# EAGLE design teensy_amp_loads_of_switches (EAGLE 9.6.2)
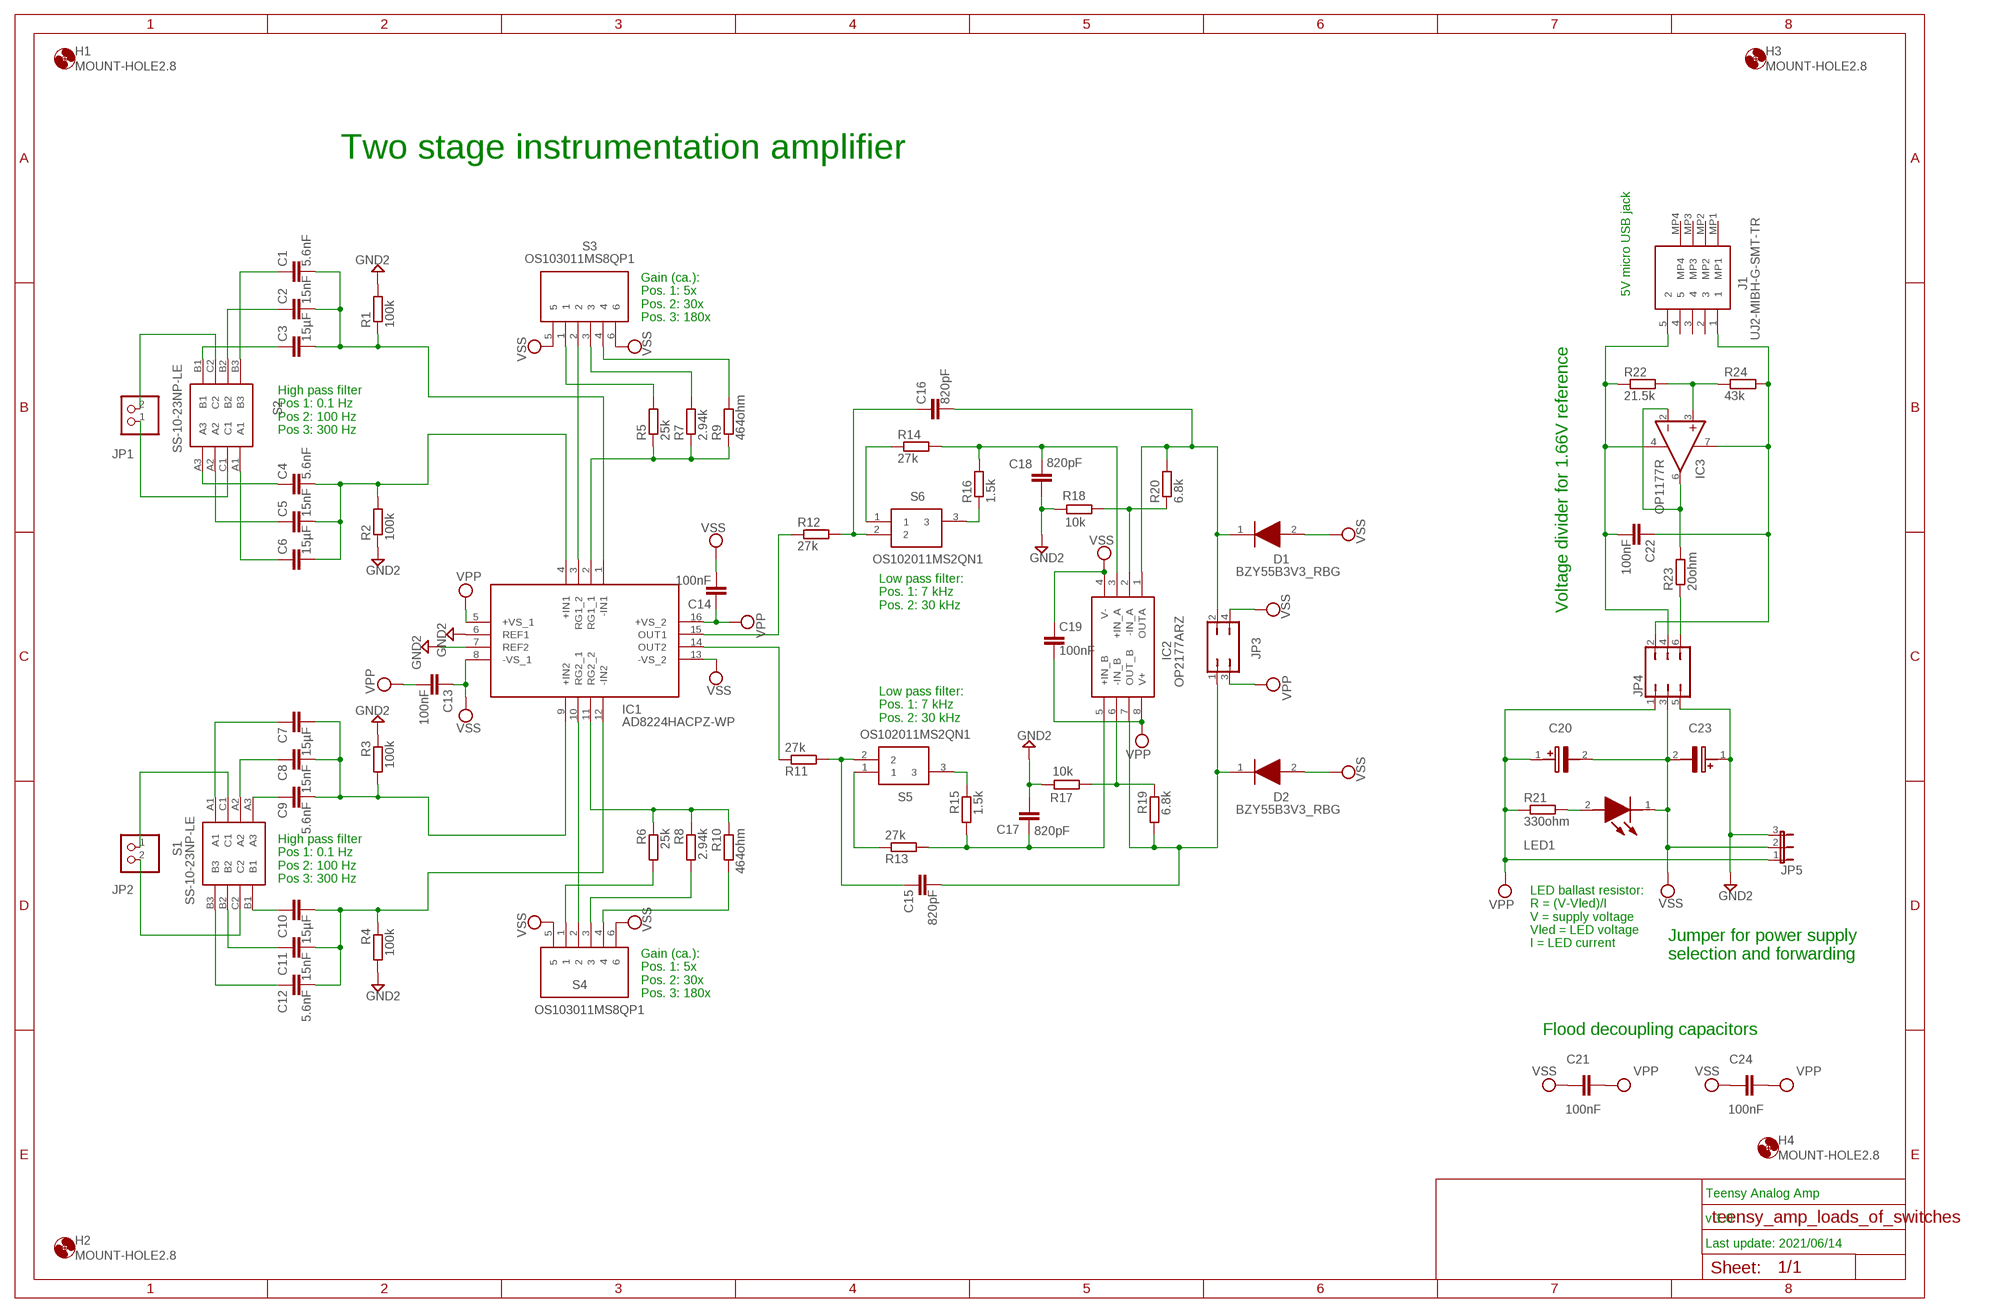
[diagram p0: schematic, sheet 1]

## Parts
C1  5.6nF  C-EUC0805  [C0805]
C2  15nF  C-EUC0805  [C0805]
C3  15µF  C-EUC0805  [C0805]
C4  5.6nF  C-EUC0805  [C0805]
C5  15nF  C-EUC0805  [C0805]
C6  15µF  C-EUC0805  [C0805]
C7  15µF  C-EUC0805  [C0805]
C8  15nF  C-EUC0805  [C0805]
C9  5.6nF  C-EUC0805  [C0805]
C10  15µF  C-EUC0805  [C0805]
C11  15nF  C-EUC0805  [C0805]
C12  5.6nF  C-EUC0805  [C0805]
C13  100nF  C-EUC0805  [C0805]
C14  100nF  C-EUC0805  [C0805]
C15  820pF  C-EUC0805  [C0805]
C16  820pF  C-EUC0805  [C0805]
C17  820pF  C-EUC0805  [C0805]
C18  820pF  C-EUC0805  [C0805]
C19  100nF  C-EUC0805  [C0805]
C20  TAJA475K010RNJV  [CAPPM3216X180N]
C21  100nF  C-EUC0805  [C0805]
C22  100nF  C-EUC0805  [C0805]
C23  TAJA475K010RNJV  [CAPPM3216X180N]
C24  100nF  C-EUC0805  [C0805]
D1  BZY55B3V3_RBG  [BZY55B3V3RBG]
D2  BZY55B3V3_RBG  [BZY55B3V3RBG]
H1  MOUNT-HOLE2.8  [2,8]
H2  MOUNT-HOLE2.8  [2,8]
H3  MOUNT-HOLE2.8  [2,8]
H4  MOUNT-HOLE2.8  [2,8]
IC1  AD8224HACPZ-WP  [QFN65P400X400X100-16N]
IC2  OP2177ARZ  [SOIC127P600X175-8N]
IC3  OP1177R  [SOIC8]
J1  UJ2-MIBH-G-SMT-TR  [UJ2MIBHGSMTTR]
JP1  PINHD-1X2  [1X02]
JP2  PINHD-1X2  [1X02]
JP3  JP2Q  [JP2Q]
JP4  JP3Q  [JP3Q]
JP5  JP2E  [JP2]
LED1  150060RS75000  [LEDC1608X80N]
R1  100k  R-EU_R0805  [R0805]
R2  100k  R-EU_R0805  [R0805]
R3  100k  R-EU_R0805  [R0805]
R4  100k  R-EU_R0805  [R0805]
R5  25k  R-EU_R0805  [R0805]
R6  25k  R-EU_R0805  [R0805]
R7  2.94k  R-EU_R0805  [R0805]
R8  2.94k  R-EU_R0805  [R0805]
R9  464ohm  R-EU_R0805  [R0805]
R10  464ohm  R-EU_R0805  [R0805]
R11  27k  R-EU_R0805  [R0805]
R12  27k  R-EU_R0805  [R0805]
R13  27k  R-EU_R0805  [R0805]
R14  27k  R-EU_R0805  [R0805]
R15  1.5k  R-EU_R0805  [R0805]
R16  1.5k  R-EU_R0805  [R0805]
R17  10k  R-EU_R0805  [R0805]
R18  10k  R-EU_R0805  [R0805]
R19  6.8k  R-EU_R0805  [R0805]
R20  6.8k  R-EU_R0805  [R0805]
R21  330ohm  R-EU_R0805  [R0805]
R22  21.5k  R-EU_R0805  [R0805]
R23  20ohm  R-EU_R0805  [R0805]
R24  43k  R-EU_R0805  [R0805]
S1  SS-10-23NP-LE  [SS1023NPLE]
S2  SS-10-23NP-LE  [SS1023NPLE]
S3  OS103011MS8QP1  [OS103011MS8QP1]
S4  OS103011MS8QP1  [OS103011MS8QP1]
S5  OS102011MS2QN1  [OS102011MA1QN1]
S6  OS102011MS2QN1  [OS102011MA1QN1]

## Nets
GND2: C17.2 C18.2 C23.1(+) IC1.6(REF1) IC1.7(REF2) JP4.5 JP5.3 R1.2 R2.1 R3.1 R4.2 R17.2 R18.2
N$1: JP1.2 S2.C2
N$2: JP1.1 S2.C1
N$3: C16.1 R12.2 S6.2
N$4: C4.1 S2.A3
N$5: C5.1 S2.A2
N$6: C6.1 S2.A1
N$7: LED1.2(A) R21.2
N$8: C22.2 IC3.4(V-) J1.5 JP4.4 R22.1
N$9: IC3.3(+IN) R22.2 R24.1
N$10: IC3.2(-IN) IC3.6(OUT) R23.2
N$11: C22.1 IC3.7(V+) J1.1 JP4.2 R24.2
N$12: C3.1 S2.B1
N$14: C1.1 S2.B3
N$15: C4.2 C5.2 C6.2 IC1.4(+IN1) R2.2
N$16: C1.2 C2.2 C3.2 IC1.1(-IN1) R1.1
N$17: C2.1 S2.B2
N$18: IC1.3(RG1_2) S3.2
N$19: IC1.15(OUT1) R12.1
N$20: IC2.2(-IN_A) R18.1 R20.1
N$21: C11.1 S1.B2
N$22: C18.1 IC2.3(+IN_A) R14.2 R16.2
N$23: R6.2 S4.1
N$24: R8.2 S4.3
N$25: R10.2 S4.4
N$26: IC1.11(RG2_2) R6.1 R8.1 R10.1
N$27: JP2.2 S1.C2
N$28: JP2.1 S1.C1
N$29: C9.1 S1.A3
N$30: R5.2 S3.1
N$31: R7.2 S3.3
N$32: R9.2 S3.4
N$33: IC1.2(RG1_1) R5.1 R7.1 R9.1
N$34: C8.1 S1.A2
N$35: C7.1 S1.A1
N$36: C10.1 S1.B1
N$37: C12.1 S1.B3
N$38: C7.2 C8.2 C9.2 IC1.9(+IN2) R3.2
N$39: C10.2 C11.2 C12.2 IC1.12(-IN2) R4.1
N$40: IC1.10(RG2_1) S4.2
N$41: JP4.6 R23.1
N$46: R14.1 S6.1
N$47: C16.2 D1.1(K) IC2.1(OUTA) JP3.2 R20.2
N$48: R16.1 S6.3
N$49: IC1.14(OUT2) R11.1
N$50: C17.1 IC2.5(+IN_B) R13.2 R15.2
N$51: IC2.6(-IN_B) R17.1 R19.1
N$52: C15.2 D2.1(K) IC2.7(OUT_B) JP3.1 R19.2
N$53: R13.1 S5.1
N$54: C15.1 R11.2 S5.2
N$55: R15.1 S5.3
VPP: C13.2 C14.1 C19.2 C20.1(+) C21.2 C24.2 IC1.5(+VS_1) IC1.16(+VS_2) IC2.8(V+) JP3.3 JP4.1 JP5.1 R21.1
VSS: C13.1 C14.2 C19.1 C20.2(-) C21.1 C23.2(-) C24.1 D1.2(A) D2.2(A) IC1.8(-VS_1) IC1.13(-VS_2) IC2.4(V-) JP3.4 JP4.3 JP5.2 LED1.1(K) S3.5 S3.6 S4.5 S4.6
Unconnected: J1.2 J1.3 J1.4 J1.MP1 J1.MP2 J1.MP3 J1.MP4

## Notes on the sheet
- Two stage instrumentation amplifier
- 5V micro USB jack
- Gain (ca.):
  Pos. 1: 5x
  Pos. 2: 30x
  Pos. 3: 180x
- Voltage divider for 1.66V reference
- High pass filter
  Pos 1: 0.1 Hz
  Pos 2: 100 Hz
  Pos 3: 300 Hz
- Low pass filter:
  Pos. 1: 7 kHz
  Pos. 2: 30 kHz
- Low pass filter:
  Pos. 1: 7 kHz
  Pos. 2: 30 kHz
- High pass filter
  Pos 1: 0.1 Hz
  Pos 2: 100 Hz
  Pos 3: 300 Hz
- LED ballast resistor:
  R = (V-Vled)/I
  V = supply voltage
  Vled = LED voltage
  I = LED current
- Jumper for power supply
  selection and forwarding
- Gain (ca.):
  Pos. 1: 5x
  Pos. 2: 30x
  Pos. 3: 180x
- Flood decoupling capacitors
- Teensy Analog Amp
- v 1.0
- Last update: 2021/06/14

## Library data of the parts
C1-C19 C21 C22 C24 = rcl:C-EU: CAPACITOR, European symbol; SPICEPREFIX: C
C20 C23 = SamacSys_Parts:TAJA475K010RNJV: Tantalum Capacitors - Solid SMD 10V 4.7uF 10% 1206 ESR = 5 Ohms Source: Datasheet; DESCRIPTION: Tantalum Capacitors - Solid SMD 10V 4.7uF 10% 1206 ESR = 5 Ohms; HEIGHT: 1.8mm; MANUFACTURER_NAME: AVX; MANUFACTURER_PART_NUMBER: TAJA475K010RNJV; MOUSER_PART_NUMBER: 581-TAJA475K010RNJV; MOUSER_PRICE-STOCK: https://www.mouser.co.uk/ProductDetail/AVX/TAJA475K010RNJV?qs=VymPLiRQZITld0CPYYWYtw%3D%3D
D1 D2 = SamacSys_Parts:BZY55B3V3_RBG: - Tape and Reel Source: Datasheet <https://componentsearchengine.com/Datasheets/1/BZY55B3V3 RBG.pdf>; DESCRIPTION: - Tape and Reel; HEIGHT: 0.85mm; MANUFACTURER_NAME: Taiwan Semiconductor; MANUFACTURER_PART_NUMBER: BZY55B3V3 RBG; MOUSER_PART_NUMBER: 821-BZY55B3V3RBG; MOUSER_PRICE-STOCK: https://www.mouser.co.uk/ProductDetail/Taiwan-Semiconductor/BZY55B3V3-RBG?qs=mAH9sUMRCtvrJdI%2FtfeTug%3D%3D
H1-H4 = holes:MOUNT-HOLE: MOUNTING HOLE with drill center marker
IC1 = SamacSys_Parts:AD8224HACPZ-WP: Precision, Dual-Channel, JFET Input,Rail-to-Rail Instrumentation Amplifier Source: Datasheet <https://componentsearchengine.com/Datasheets/2/AD8224HACPZ-WP.pdf>; DESCRIPTION: Precision, Dual-Channel, JFET Input,Rail-to-Rail Instrumentation Amplifier; HEIGHT: 1mm; MANUFACTURER_NAME: Analog Devices; MANUFACTURER_PART_NUMBER: AD8224HACPZ-WP; MOUSER_PART_NUMBER: 584-AD8224HACPZ-WP; MOUSER_PRICE-STOCK: https://www.mouser.co.uk/ProductDetail/Analog-Devices/AD8224HACPZ-WP?qs=%2FtpEQrCGXCwdne337I0uOQ%3D%3D
IC2 = SamacSys_Parts:OP2177ARZ: OP2177ARZ, Dual Operational Amplifier 1.3MHz, 8-Pin SOIC Source: Datasheet; DESCRIPTION: OP2177ARZ, Dual Operational Amplifier 1.3MHz, 8-Pin SOIC; HEIGHT: 1.75mm; MANUFACTURER_NAME: Analog Devices; MANUFACTURER_PART_NUMBER: OP2177ARZ; MOUSER_PART_NUMBER: 584-OP2177ARZ; MOUSER_PRICE-STOCK: https://www.mouser.co.uk/ProductDetail/Analog-Devices/OP2177ARZ?qs=WIvQP4zGaniPKKe90KoQ%252BA%3D%3D
IC3 = linear:OP1177: Precision Low Noise, Low Input Bias Current Operational Amplifiers Source: OP1177_2177_4177.pdf
J1 = SamacSys_Parts:UJ2-MIBH-G-SMT-TR: USB Connectors Source: Datasheet; DESCRIPTION: USB Connectors; HEIGHT: 3.15mm; MANUFACTURER_NAME: CUI Inc.; MANUFACTURER_PART_NUMBER: UJ2-MIBH-G-SMT-TR; MOUSER_PART_NUMBER: 490-UJ2-MIBH-G-SMTTR; MOUSER_PRICE-STOCK: https://www.mouser.co.uk/ProductDetail/CUI-Devices/UJ2-MIBH-G-SMT-TR?qs=IS%252B4QmGtzzpvS1XQusp0iA%3D%3D
JP1 JP2 = pinhead:PINHD-1X2: PIN HEADER
JP3 = jumper:JP2Q: JUMPER
JP4 = jumper:JP3Q: JUMPER
JP5 = jumper:JP2E: JUMPER
LED1 = SamacSys_Parts:150060RS75000: WURTH ELEKTRONIK - 150060RS75000 - LED, 0603, RED, 250MCD, 625NM Source: Datasheet <http://katalog.we-online.de/led/datasheet/150060RS75000.pdf>; DESCRIPTION: WURTH ELEKTRONIK - 150060RS75000 - LED, 0603, RED, 250MCD, 625NM; HEIGHT: 0.8mm; MANUFACTURER_NAME: Wurth Elektronik; MANUFACTURER_PART_NUMBER: 150060RS75000; MOUSER_PART_NUMBER: 710-150060RS75000; MOUSER_PRICE-STOCK: https://www.mouser.co.uk/ProductDetail/Wurth-Elektronik/150060RS75000?qs=LlUlMxKIyB3QnmZ3fw%2FVCA%3D%3D
R1-R24 = rcl:R-EU_: RESISTOR, European symbol; SPICEPREFIX: R
S1 S2 = SamacSys_Parts:SS-10-23NP-LE: Copal Electronics SS-10, 3 Position DP3T Rotary Switch, 100 mA, Solder Source: Datasheet <https://www.nidec-copal-electronics.com/e/catalog/switch/ss-10&s-2050.pdf>; DESCRIPTION: Copal Electronics SS-10, 3 Position DP3T Rotary Switch, 100 mA, Solder; HEIGHT: 7mm; MANUFACTURER_NAME: Copal Electronics; MANUFACTURER_PART_NUMBER: SS-10-23NP-LE
S3 S4 = SamacSys_Parts:OS103011MS8QP1: C & K COMPONENTS - OS103011MS8QP1 - SWITCH, SP3T, 0.1A, 12VDC, PCB, ON-ON-ON Source: Datasheet <https://www.ckswitches.com/media/1428/os.pdf>; DESCRIPTION: C & K COMPONENTS - OS103011MS8QP1 - SWITCH, SP3T, 0.1A, 12VDC, PCB, ON-ON-ON; HEIGHT: 8mm; MANUFACTURER_NAME: C & K COMPONENTS; MANUFACTURER_PART_NUMBER: OS103011MS8QP1; MOUSER_PART_NUMBER: 611-OS103011MS8QP1; MOUSER_PRICE-STOCK: https://www.mouser.co.uk/ProductDetail/CK/OS103011MS8QP1/?qs=86ySKn7Oc5W2%252Bzm5uDBfBA%3D%3D
S5 S6 = SamacSys_Parts:OS102011MS2QN1: Switch Slide Miniature SPDT 0.1A 12VDC Through Hole Slide Switch SPDT On-On 0.1 A@ 12 V dc Slide Source: Datasheet <http://www.ckswitches.com/media/1428/os.pdf>; DESCRIPTION: Switch Slide Miniature SPDT 0.1A 12VDC Through Hole Slide Switch SPDT On-On 0.1 A@ 12 V dc Slide; HEIGHT: mm; MANUFACTURER_NAME: C & K COMPONENTS; MANUFACTURER_PART_NUMBER: OS102011MS2QN1; MOUSER_PART_NUMBER: 611-OS102011MS2QN1; MOUSER_PRICE-STOCK: https://www.mouser.co.uk/ProductDetail/CK/OS102011MS2QN1?qs=WtljUlYws5RvQ1hEv876nQ%3D%3D

## Net classes
0 default: width 0.203 mm, clearance 0.205 mm

## Board
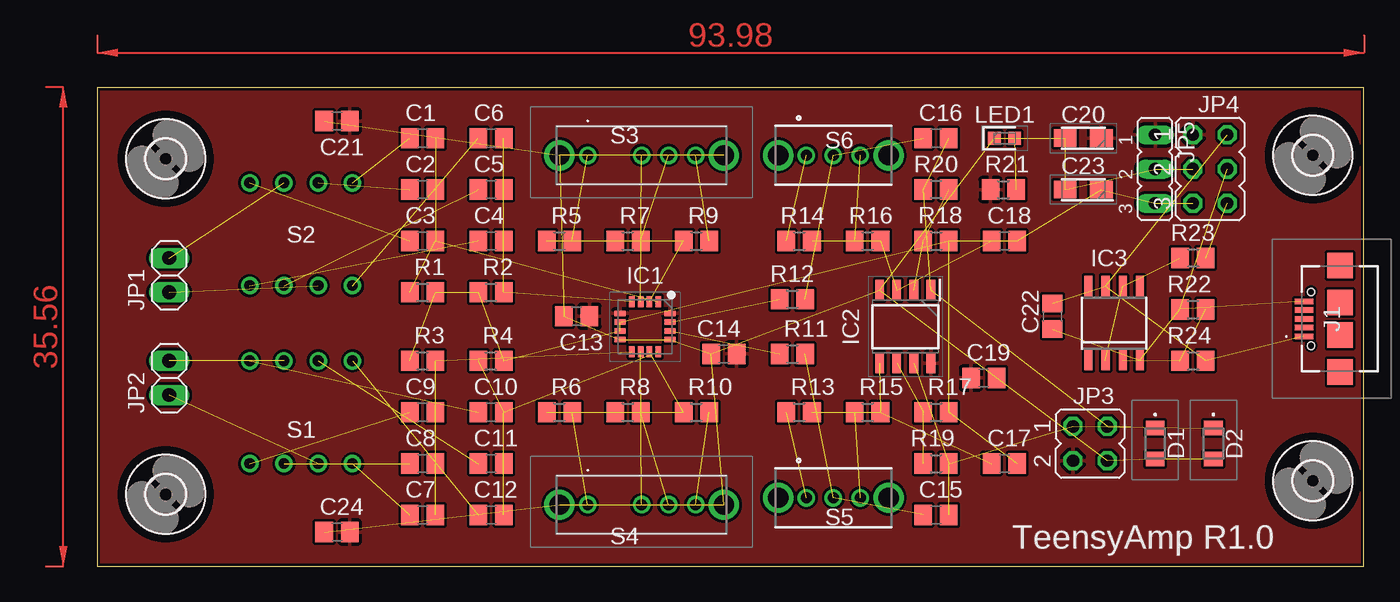
[diagram p1: board, top side]
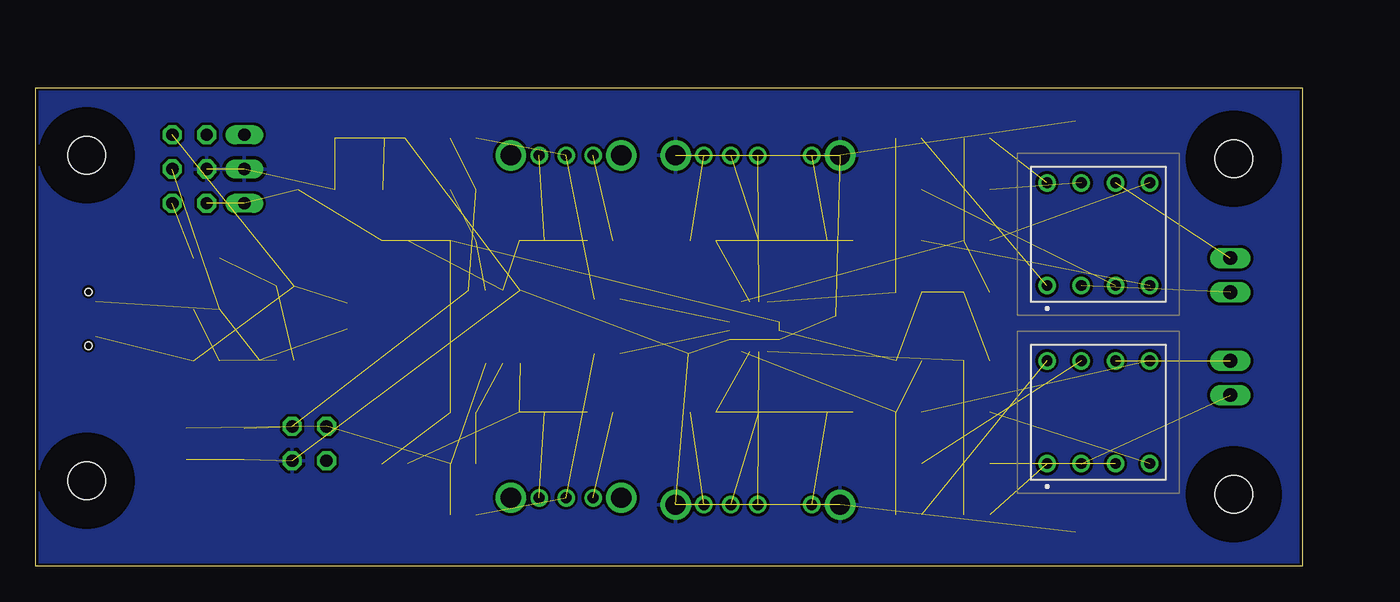
[diagram p2: board, bottom side, seen from below]

Size 93.96 x 35.48 mm. Coordinates in mm from the lower left corner, seen from the top.
Outline: 0,0 93.96,0 93.96,35.48 0,35.48 0,0
Copper layers (1*16): Top 0.035mm / dielectric 1.5mm / Bottom 0.035mm
Design rules "aisler_2_layer": minimum track width 0.1mm, minimum drill 0.2mm, track to track 0.15mm, track to pad 0.15mm, pad to pad 0.1mm, via to via 0.1mm, smd to smd 0.1mm, copper to edge 0.2mm, drill to drill 0.21mm, minimum pad ring 0.25mm, minimum via ring 0.15mm, stop-mask expansion 0mil, vias tented up to drill 0mil, thermal gap 10mil

### Footprints (pad centres in the part's own frame; a part is rotated, then mirrored left to right if it is on the bottom)
C0805 = smd 1.3 x 1.5: 1 -0.95,0; 2 0.95,0
CAPPM3216X180N = smd 1.7 x 1.3: 1 -1.35,0; 2 1.35,0
BZY55B3V3RBG = smd 1.1 x 1.4: 1 -1.15,0; 2 1.15,0
2,8 = hole 2.8: 0,0
QFN65P400X400X100-16N = smd 0.813 x 0.406: 1 -1.85,0.975; 2 -1.85,0.325; 3 -1.85,-0.325; 4 -1.85,-0.975; 9 1.85,-0.975; 10 1.85,-0.325; 11 1.85,0.325; 12 1.85,0.975 | smd 0.406 x 0.813: 5 -0.975,-1.85; 6 -0.325,-1.85; 7 0.325,-1.85; 8 0.975,-1.85; 13 0.975,1.85; 14 0.325,1.85; 15 -0.325,1.85; 16 -0.975,1.85
SOIC127P600X175-8N = smd 1.525 x 0.65: 1 -2.712,1.905; 2 -2.712,0.635; 3 -2.712,-0.635; 4 -2.712,-1.905; 5 2.712,-1.905; 6 2.712,-0.635; 7 2.712,0.635; 8 2.712,1.905
SOIC8 = smd 0.6 x 1.5: 1 -1.905,-2.75; 2 -0.635,-2.75; 3 0.635,-2.75; 4 1.905,-2.75; 5 1.905,2.75; 6 0.635,2.75; 7 -0.635,2.75; 8 -1.905,2.75
UJ2MIBHGSMTTR = smd 0.4 x 1.35: 1 -1.3,2.64; 2 -0.65,2.64; 3 0,2.64; 4 0.65,2.64; 5 1.3,2.64 | smd 1.9 x 1.9: MP1 -3.95,-0.035; MP2 -1.2,-0.035; MP3 1.2,-0.035; MP4 3.95,-0.035 | hole 0.55: -2,2.115; 2,2.115
1X02 = drill 1.016 long: 1 -1.27,0; 2 1.27,0
JP2Q = drill 0.914 octagon: 1 -1.27,-1.27; 2 -1.27,1.27; 3 1.27,-1.27; 4 1.27,1.27
JP3Q = drill 0.914 octagon: 1 -2.54,-1.27; 2 -2.54,1.27; 3 0,-1.27; 4 0,1.27; 5 2.54,-1.27; 6 2.54,1.27
JP2 = drill 0.914 long: 1 -2.54,0; 2 0,0; 3 2.54,0
LEDC1608X80N = smd 0.95 x 0.95: 1 -0.75,0; 2 0.75,0
R0805 = smd 1.3 x 1.5: 1 -0.95,0; 2 0.95,0
SS1023NPLE = drill 0.8 pad 1.3: A1 0,0; A2 5.08,0; A3 7.62,0; B1 7.62,7.62; B2 2.54,7.62; B3 0,7.62; C1 2.54,0; C2 5.08,7.62
OS103011MS8QP1 = drill 0.8 pad 1.3: 1 -4,0; 2 0,0; 3 2,0; 4 4,0 | drill 1.5 pad 2.25: 5 -6.1,0; 6 6.1,0
OS102011MA1QN1 = drill 0.8 pad 1.3: 1 -2,0; 2 0,0; 3 2,0 | drill 1.5 pad 2.25: 4 -4.1,0; 5 4.1,0

### Placement (x,y rotation side)
C1  24.13,31.75 0 top
C2  24.13,27.94 0 top
C3  24.13,24.13 0 top
C4  29.21,24.13 0 top
C5  29.21,27.94 0 top
C6  29.21,31.75 0 top
C7  24.13,3.81 0 top
C8  24.13,7.62 0 top
C9  24.13,11.43 0 top
C10  29.21,11.43 0 top
C11  29.21,7.62 0 top
C12  29.21,3.81 0 top
C13  35.56,18.54 0 top
C14  46.48,15.75 180 top
C15  62.23,3.81 0 top
C16  62.23,31.75 0 top
C17  67.31,7.62 0 top
C18  67.31,24.13 0 top
C19  65.77,13.97 180 top
C20  73.15,31.75 180 top
C21  17.78,33.02 0 top
C22  70.86,18.55 270 top
C23  73.15,27.94 180 top
C24  17.78,2.54 0 top
D1  78.48,9.1 270 top
D2  82.8,9.1 270 top
H1  5.08,30.23 0 top
H2  5.08,5.33 0 top
H3  90.17,6.35 0 top
H4  90.17,30.48 0 top
IC1  40.64,17.78 270 top
IC2  59.94,17.78 270 top
IC3  75.44,18.03 0 top
J1  92.17,18.35 90 top
JP1  5.33,21.59 90 top
JP2  5.33,13.97 90 top
JP3  73.65,9.1 270 top
JP4  82.55,29.46 270 top
JP5  78.49,29.46 270 top
LED1  67.31,31.75 0 top
R1  24.13,20.32 0 top
R2  29.21,20.32 0 top
R3  24.13,15.24 0 top
R4  29.21,15.24 0 top
R5  34.29,24.13 0 top
R6  34.29,11.43 0 top
R7  39.37,24.13 0 top
R8  39.37,11.43 0 top
R9  44.45,24.13 0 top
R10  44.45,11.43 0 top
R11  51.56,15.75 0 top
R12  51.56,19.81 0 top
R13  52.07,11.43 0 top
R14  52.07,24.13 0 top
R15  57.15,11.43 0 top
R16  57.15,24.13 0 top
R17  62.23,11.43 0 top
R18  62.23,24.13 0 top
R19  62.23,7.62 0 top
R20  62.23,27.94 180 top
R21  67.22,27.94 0 top
R22  81.28,19.05 0 top
R23  81.28,22.86 180 top
R24  81.28,15.24 0 top
S1  18.93,7.62 0 bottom
S2  18.93,20.82 0 bottom
S3  40.39,30.48 0 top
S4  40.39,4.57 0 top
S5  54.61,5.08 0 top
S6  54.61,30.48 0 top

### Tracks (layer width: path | path; a pad name or v marks a point on that pad's centre or on a via)
GND2  (12 unrouted)
N$1  (1 unrouted)
N$2  (1 unrouted)
N$3  (2 unrouted)
N$4  (1 unrouted)
N$5  (1 unrouted)
N$6  (1 unrouted)
N$7  (1 unrouted)
N$8  (4 unrouted)
N$9  (2 unrouted)
N$10  (2 unrouted)
N$11  (4 unrouted)
N$12  (1 unrouted)
N$14  (1 unrouted)
N$15  (4 unrouted)
N$16  (4 unrouted)
N$17  (1 unrouted)
N$18  (1 unrouted)
N$19  (1 unrouted)
N$20  (2 unrouted)
N$21  (1 unrouted)
N$22  (3 unrouted)
N$23  (1 unrouted)
N$24  (1 unrouted)
N$25  (1 unrouted)
N$26  (3 unrouted)
N$27  (1 unrouted)
N$28  (1 unrouted)
N$29  (1 unrouted)
N$30  (1 unrouted)
N$31  (1 unrouted)
N$32  (1 unrouted)
N$33  (3 unrouted)
N$34  (1 unrouted)
N$35  (1 unrouted)
N$36  (1 unrouted)
N$37  (1 unrouted)
N$38  (4 unrouted)
N$39  (4 unrouted)
N$40  (1 unrouted)
N$41  (1 unrouted)
N$46  (1 unrouted)
N$47  (4 unrouted)
N$48  (1 unrouted)
N$49  (1 unrouted)
N$50  (3 unrouted)
N$51  (2 unrouted)
N$52  (4 unrouted)
N$53  (1 unrouted)
N$54  (2 unrouted)
N$55  (1 unrouted)
VPP
  pour Top: 0,34.29 0,35.56 93.98,35.56 93.98,0 0,0
VSS  (19 unrouted)
  pour Bottom: 0,35.56 93.98,35.56 93.98,0 0,0
(copper drawn outside any net)
  shapes: Top area x2

### Text on the board
tNames: TeensyAmp R1.0